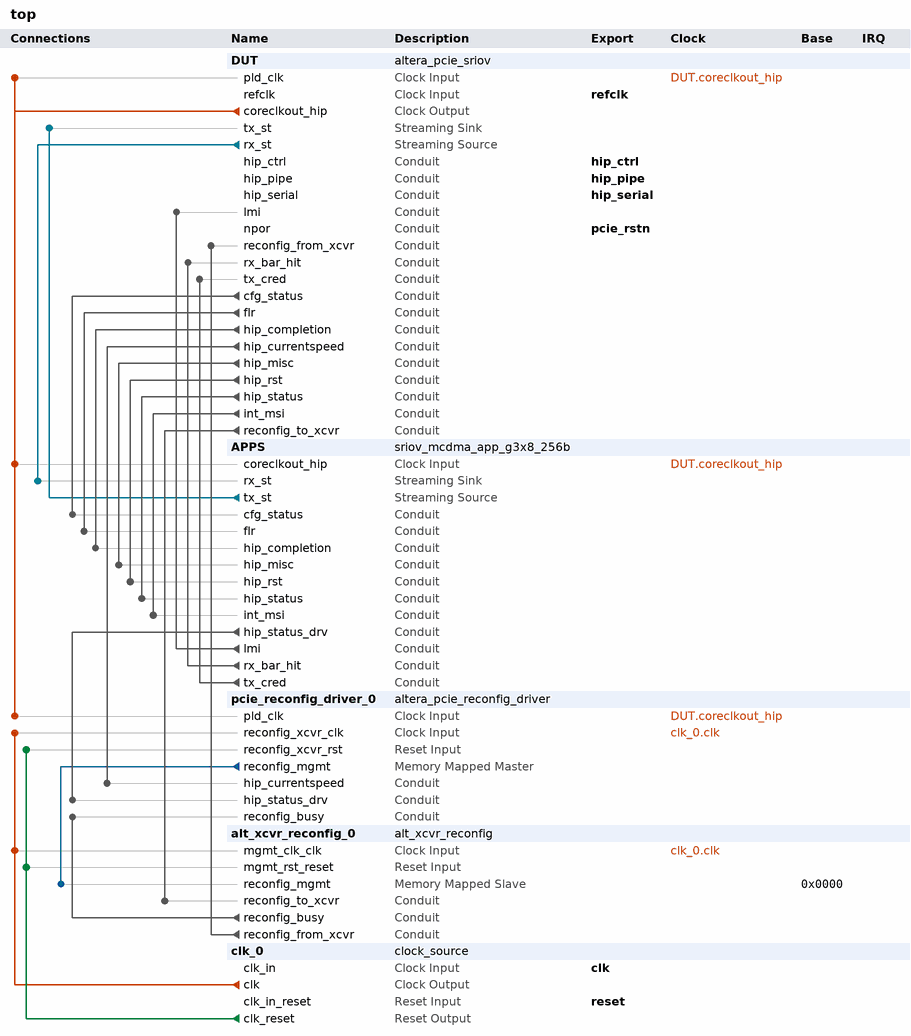
[diagram p0: system contents]
# Platform Designer (Qsys) system top, Stratix V Unknown
# Parameters at their usual value, and those the tool derives, are not listed.
package require -exact qsys 14.1
create_system top
set_project_property DEVICE_FAMILY {Stratix V}
set_project_property DEVICE Unknown

add_instance DUT altera_pcie_sriov 14.1
set_instance_parameter_value DUT ACDS_VERSION_HWTCL 14.0
set_instance_parameter_value DUT ARI_SUPPORT 1
set_instance_parameter_value DUT DROP_POISONED_COMPL 0
set_instance_parameter_value DUT DROP_POISONED_REQ 0
set_instance_parameter_value DUT LOG_VF_ERRORS_IN_PF 0
set_instance_parameter_value DUT PF0_BAR0_PREFETCHABLE 1
set_instance_parameter_value DUT PF0_BAR0_PRESENT 1
set_instance_parameter_value DUT PF0_BAR0_SIZE 17
set_instance_parameter_value DUT PF0_BAR0_TYPE 1
set_instance_parameter_value DUT PF0_BAR1_PREFETCHABLE 1
set_instance_parameter_value DUT PF0_BAR1_PRESENT 0
set_instance_parameter_value DUT PF0_BAR1_SIZE 12
set_instance_parameter_value DUT PF0_BAR2_PREFETCHABLE 1
set_instance_parameter_value DUT PF0_BAR2_PRESENT 0
set_instance_parameter_value DUT PF0_BAR2_SIZE 12
set_instance_parameter_value DUT PF0_BAR2_TYPE 1
set_instance_parameter_value DUT PF0_BAR3_PREFETCHABLE 1
set_instance_parameter_value DUT PF0_BAR3_PRESENT 0
set_instance_parameter_value DUT PF0_BAR3_SIZE 12
set_instance_parameter_value DUT PF0_BAR4_PREFETCHABLE 1
set_instance_parameter_value DUT PF0_BAR4_PRESENT 0
set_instance_parameter_value DUT PF0_BAR4_SIZE 12
set_instance_parameter_value DUT PF0_BAR4_TYPE 1
set_instance_parameter_value DUT PF0_BAR5_PREFETCHABLE 1
set_instance_parameter_value DUT PF0_BAR5_PRESENT 0
set_instance_parameter_value DUT PF0_BAR5_SIZE 12
set_instance_parameter_value DUT PF0_INTR_LINE 0
set_instance_parameter_value DUT PF0_PCI_PROG_INTFC_BYTE 0
set_instance_parameter_value DUT PF0_SUBCLASS_CODE 0
set_instance_parameter_value DUT PF0_VF_BAR0_PREFETCHABLE 1
set_instance_parameter_value DUT PF0_VF_BAR0_PRESENT 1
set_instance_parameter_value DUT PF0_VF_BAR0_SIZE 16
set_instance_parameter_value DUT PF0_VF_BAR0_TYPE 1
set_instance_parameter_value DUT PF0_VF_BAR1_PREFETCHABLE 1
set_instance_parameter_value DUT PF0_VF_BAR1_PRESENT 0
set_instance_parameter_value DUT PF0_VF_BAR1_SIZE 12
set_instance_parameter_value DUT PF0_VF_BAR2_PREFETCHABLE 1
set_instance_parameter_value DUT PF0_VF_BAR2_PRESENT 0
set_instance_parameter_value DUT PF0_VF_BAR2_SIZE 12
set_instance_parameter_value DUT PF0_VF_BAR2_TYPE 1
set_instance_parameter_value DUT PF0_VF_BAR3_PREFETCHABLE 1
set_instance_parameter_value DUT PF0_VF_BAR3_PRESENT 0
set_instance_parameter_value DUT PF0_VF_BAR3_SIZE 12
set_instance_parameter_value DUT PF0_VF_BAR4_PREFETCHABLE 1
set_instance_parameter_value DUT PF0_VF_BAR4_PRESENT 0
set_instance_parameter_value DUT PF0_VF_BAR4_SIZE 12
set_instance_parameter_value DUT PF0_VF_BAR4_TYPE 1
set_instance_parameter_value DUT PF0_VF_BAR5_PREFETCHABLE 1
set_instance_parameter_value DUT PF0_VF_BAR5_PRESENT 0
set_instance_parameter_value DUT PF0_VF_BAR5_SIZE 12
set_instance_parameter_value DUT PF0_VF_COUNT_USER 4
set_instance_parameter_value DUT PF0_VF_DEVICE_ID 51966
set_instance_parameter_value DUT PF0_VF_MSIX_PBA_BIR 0
set_instance_parameter_value DUT PF0_VF_MSIX_PBA_OFFSET 8192
set_instance_parameter_value DUT PF0_VF_MSIX_TBL_BIR 0
set_instance_parameter_value DUT PF0_VF_MSIX_TBL_OFFSET 4096
set_instance_parameter_value DUT PF0_VF_MSIX_TBL_SIZE 128
set_instance_parameter_value DUT PF1_BAR0_PREFETCHABLE 1
set_instance_parameter_value DUT PF1_BAR0_PRESENT 0
set_instance_parameter_value DUT PF1_BAR0_SIZE 12
set_instance_parameter_value DUT PF1_BAR0_TYPE 1
set_instance_parameter_value DUT PF1_BAR1_PREFETCHABLE 1
set_instance_parameter_value DUT PF1_BAR1_PRESENT 0
set_instance_parameter_value DUT PF1_BAR1_SIZE 12
set_instance_parameter_value DUT PF1_BAR2_PREFETCHABLE 1
set_instance_parameter_value DUT PF1_BAR2_PRESENT 0
set_instance_parameter_value DUT PF1_BAR2_SIZE 12
set_instance_parameter_value DUT PF1_BAR2_TYPE 1
set_instance_parameter_value DUT PF1_BAR3_PREFETCHABLE 1
set_instance_parameter_value DUT PF1_BAR3_PRESENT 0
set_instance_parameter_value DUT PF1_BAR3_SIZE 12
set_instance_parameter_value DUT PF1_BAR4_PREFETCHABLE 1
set_instance_parameter_value DUT PF1_BAR4_PRESENT 0
set_instance_parameter_value DUT PF1_BAR4_SIZE 12
set_instance_parameter_value DUT PF1_BAR4_TYPE 1
set_instance_parameter_value DUT PF1_BAR5_PREFETCHABLE 1
set_instance_parameter_value DUT PF1_BAR5_PRESENT 0
set_instance_parameter_value DUT PF1_BAR5_SIZE 12
set_instance_parameter_value DUT PF1_INTR_LINE 0
set_instance_parameter_value DUT PF1_PCI_PROG_INTFC_BYTE 0
set_instance_parameter_value DUT PF1_SUBCLASS_CODE 0
set_instance_parameter_value DUT PF1_VF_BAR0_PREFETCHABLE 1
set_instance_parameter_value DUT PF1_VF_BAR0_PRESENT 0
set_instance_parameter_value DUT PF1_VF_BAR0_SIZE 12
set_instance_parameter_value DUT PF1_VF_BAR0_TYPE 1
set_instance_parameter_value DUT PF1_VF_BAR1_PREFETCHABLE 1
set_instance_parameter_value DUT PF1_VF_BAR1_PRESENT 0
set_instance_parameter_value DUT PF1_VF_BAR1_SIZE 12
set_instance_parameter_value DUT PF1_VF_BAR2_PREFETCHABLE 1
set_instance_parameter_value DUT PF1_VF_BAR2_PRESENT 0
set_instance_parameter_value DUT PF1_VF_BAR2_SIZE 12
set_instance_parameter_value DUT PF1_VF_BAR2_TYPE 1
set_instance_parameter_value DUT PF1_VF_BAR3_PREFETCHABLE 1
set_instance_parameter_value DUT PF1_VF_BAR3_PRESENT 0
set_instance_parameter_value DUT PF1_VF_BAR3_SIZE 12
set_instance_parameter_value DUT PF1_VF_BAR4_PREFETCHABLE 1
set_instance_parameter_value DUT PF1_VF_BAR4_PRESENT 0
set_instance_parameter_value DUT PF1_VF_BAR4_SIZE 12
set_instance_parameter_value DUT PF1_VF_BAR4_TYPE 1
set_instance_parameter_value DUT PF1_VF_BAR5_PREFETCHABLE 1
set_instance_parameter_value DUT PF1_VF_BAR5_PRESENT 0
set_instance_parameter_value DUT PF1_VF_BAR5_SIZE 12
set_instance_parameter_value DUT PF1_VF_COUNT_USER 0
set_instance_parameter_value DUT PF1_VF_DEVICE_ID 0
set_instance_parameter_value DUT PF1_VF_MSIX_PBA_BIR 0
set_instance_parameter_value DUT PF1_VF_MSIX_PBA_OFFSET 0
set_instance_parameter_value DUT PF1_VF_MSIX_TBL_BIR 0
set_instance_parameter_value DUT PF1_VF_MSIX_TBL_OFFSET 0
set_instance_parameter_value DUT PF1_VF_MSIX_TBL_SIZE 0
set_instance_parameter_value DUT RELAXED_ORDER_SUPPORT 1
set_instance_parameter_value DUT SIG_TEST_EN 0
set_instance_parameter_value DUT SIM_SRIOV_DMA 1
set_instance_parameter_value DUT SR_IOV_SUPPORT 1
set_instance_parameter_value DUT SYSTEM_PAGE_SIZES_SUPPORTED 1363
set_instance_parameter_value DUT TOTAL_PF_COUNT 1
set_instance_parameter_value DUT VF_MSIX_CAP_PRESENT 1
set_instance_parameter_value DUT advanced_default_hwtcl_atomic_malformed true
set_instance_parameter_value DUT advanced_default_hwtcl_atomic_op_completer_32bit false
set_instance_parameter_value DUT advanced_default_hwtcl_atomic_op_completer_64bit false
set_instance_parameter_value DUT advanced_default_hwtcl_atomic_op_routing false
set_instance_parameter_value DUT advanced_default_hwtcl_bridge_port_ssid_support false
set_instance_parameter_value DUT advanced_default_hwtcl_bridge_port_vga_enable false
set_instance_parameter_value DUT advanced_default_hwtcl_bypass_cdc false
set_instance_parameter_value DUT advanced_default_hwtcl_cas_completer_128bit false
set_instance_parameter_value DUT advanced_default_hwtcl_cdc_dummy_insert_limit 11
set_instance_parameter_value DUT advanced_default_hwtcl_d0_pme false
set_instance_parameter_value DUT advanced_default_hwtcl_d1_pme false
set_instance_parameter_value DUT advanced_default_hwtcl_d1_support false
set_instance_parameter_value DUT advanced_default_hwtcl_d2_pme false
set_instance_parameter_value DUT advanced_default_hwtcl_d2_support false
set_instance_parameter_value DUT advanced_default_hwtcl_d3_cold_pme false
set_instance_parameter_value DUT advanced_default_hwtcl_d3_hot_pme false
set_instance_parameter_value DUT advanced_default_hwtcl_data_pack_rx disable
set_instance_parameter_value DUT advanced_default_hwtcl_deskew_comma com_deskw
set_instance_parameter_value DUT advanced_default_hwtcl_device_number 0
set_instance_parameter_value DUT advanced_default_hwtcl_disable_link_x2_support false
set_instance_parameter_value DUT advanced_default_hwtcl_disable_snoop_packet false
set_instance_parameter_value DUT advanced_default_hwtcl_ei_delay_powerdown_count 10
set_instance_parameter_value DUT advanced_default_hwtcl_eie_before_nfts_count 4
set_instance_parameter_value DUT advanced_default_hwtcl_enable_adapter_half_rate_mode false
set_instance_parameter_value DUT advanced_default_hwtcl_enable_l1_aspm false
set_instance_parameter_value DUT advanced_default_hwtcl_enable_rx_buffer_checking false
set_instance_parameter_value DUT advanced_default_hwtcl_extended_format_field false
set_instance_parameter_value DUT advanced_default_hwtcl_extended_tag_reset false
set_instance_parameter_value DUT advanced_default_hwtcl_fc_init_timer 1024
set_instance_parameter_value DUT advanced_default_hwtcl_flow_control_timeout_count 200
set_instance_parameter_value DUT advanced_default_hwtcl_flow_control_update_count 30
set_instance_parameter_value DUT advanced_default_hwtcl_flr_capability false
set_instance_parameter_value DUT advanced_default_hwtcl_gen2_diffclock_nfts_count 255
set_instance_parameter_value DUT advanced_default_hwtcl_gen2_sameclock_nfts_count 255
set_instance_parameter_value DUT advanced_default_hwtcl_hot_plug_support 0
set_instance_parameter_value DUT advanced_default_hwtcl_interrupt_pin inta
set_instance_parameter_value DUT advanced_default_hwtcl_l01_entry_latency 31
set_instance_parameter_value DUT advanced_default_hwtcl_l0_exit_latency_diffclock 6
set_instance_parameter_value DUT advanced_default_hwtcl_l0_exit_latency_sameclock 6
set_instance_parameter_value DUT advanced_default_hwtcl_l1_exit_latency_diffclock 0
set_instance_parameter_value DUT advanced_default_hwtcl_l1_exit_latency_sameclock 0
set_instance_parameter_value DUT advanced_default_hwtcl_low_priority_vc single_vc
set_instance_parameter_value DUT advanced_default_hwtcl_ltr_mechanism false
set_instance_parameter_value DUT advanced_default_hwtcl_ltssm_1ms_timeout disable
set_instance_parameter_value DUT advanced_default_hwtcl_ltssm_freqlocked_check disable
set_instance_parameter_value DUT advanced_default_hwtcl_maximum_current 0
set_instance_parameter_value DUT advanced_default_hwtcl_no_command_completed true
set_instance_parameter_value DUT advanced_default_hwtcl_no_soft_reset false
set_instance_parameter_value DUT advanced_default_hwtcl_pclk_out_sel pclk
set_instance_parameter_value DUT advanced_default_hwtcl_pipex1_debug_sel disable
set_instance_parameter_value DUT advanced_default_hwtcl_register_pipe_signals false
set_instance_parameter_value DUT advanced_default_hwtcl_reserved_debug 0
set_instance_parameter_value DUT advanced_default_hwtcl_retry_buffer_last_active_address 2047
set_instance_parameter_value DUT advanced_default_hwtcl_rx_l0s_count_idl 0
set_instance_parameter_value DUT advanced_default_hwtcl_set_l0s 0
set_instance_parameter_value DUT advanced_default_hwtcl_skp_os_gen3_count 0
set_instance_parameter_value DUT advanced_default_hwtcl_skp_os_schedule_count 0
set_instance_parameter_value DUT advanced_default_hwtcl_ssid 0
set_instance_parameter_value DUT advanced_default_hwtcl_ssvid 0
set_instance_parameter_value DUT advanced_default_hwtcl_tph_completer false
set_instance_parameter_value DUT advanced_default_hwtcl_tx_cdc_almost_empty 5
set_instance_parameter_value DUT advanced_default_hwtcl_vc0_clk_enable true
set_instance_parameter_value DUT advanced_default_hwtcl_wrong_device_id disable
set_instance_parameter_value DUT advanced_default_parameter_override 0
set_instance_parameter_value DUT ast_width_hwtcl {Avalon-ST 256-bit}
set_instance_parameter_value DUT change_deemphasis_hwtcl 0
set_instance_parameter_value DUT class_code_hwtcl 2
set_instance_parameter_value DUT completion_timeout_hwtcl ABCD
set_instance_parameter_value DUT device_id_hwtcl 57345
set_instance_parameter_value DUT dll_active_report_support_hwtcl 0
set_instance_parameter_value DUT ecrc_check_capable_hwtcl 0
set_instance_parameter_value DUT ecrc_gen_capable_hwtcl 0
set_instance_parameter_value DUT enable_completion_timeout_disable_hwtcl 1
set_instance_parameter_value DUT enable_function_msix_support_hwtcl 1
set_instance_parameter_value DUT enable_pcisigtest_hwtcl 0
set_instance_parameter_value DUT enable_pipe32_phyip_ser_driver_hwtcl 0
set_instance_parameter_value DUT enable_pipe32_sim_hwtcl 0
set_instance_parameter_value DUT enable_power_on_rst_pulse_hwtcl 0
set_instance_parameter_value DUT enable_slot_register_hwtcl 0
set_instance_parameter_value DUT enable_tl_only_sim_hwtcl 0
set_instance_parameter_value DUT endpoint_l0_latency_hwtcl 0
set_instance_parameter_value DUT endpoint_l1_latency_hwtcl 0
set_instance_parameter_value DUT extend_tag_field_hwtcl 32
set_instance_parameter_value DUT fixed_preset_on 0
set_instance_parameter_value DUT force_hrc 0
set_instance_parameter_value DUT force_src 0
set_instance_parameter_value DUT full_swing_hwtcl 35
set_instance_parameter_value DUT gen123_lane_rate_mode_hwtcl {Gen3 (8.0 Gbps)}
set_instance_parameter_value DUT gen3_coeff_10_ber_meas_hwtcl 0
set_instance_parameter_value DUT gen3_coeff_10_hwtcl 0
set_instance_parameter_value DUT gen3_coeff_10_nxtber_less_hwtcl g3_coeff_10_nxtber_less
set_instance_parameter_value DUT gen3_coeff_10_nxtber_less_ptr_hwtcl 0
set_instance_parameter_value DUT gen3_coeff_10_nxtber_more_hwtcl g3_coeff_10_nxtber_more
set_instance_parameter_value DUT gen3_coeff_10_nxtber_more_ptr_hwtcl 0
set_instance_parameter_value DUT gen3_coeff_10_preset_hint_hwtcl 0
set_instance_parameter_value DUT gen3_coeff_10_reqber_hwtcl 0
set_instance_parameter_value DUT gen3_coeff_10_sel_hwtcl preset_10
set_instance_parameter_value DUT gen3_coeff_11_ber_meas_hwtcl 0
set_instance_parameter_value DUT gen3_coeff_11_hwtcl 0
set_instance_parameter_value DUT gen3_coeff_11_nxtber_less_hwtcl g3_coeff_11_nxtber_less
set_instance_parameter_value DUT gen3_coeff_11_nxtber_less_ptr_hwtcl 0
set_instance_parameter_value DUT gen3_coeff_11_nxtber_more_hwtcl g3_coeff_11_nxtber_more
set_instance_parameter_value DUT gen3_coeff_11_nxtber_more_ptr_hwtcl 0
set_instance_parameter_value DUT gen3_coeff_11_preset_hint_hwtcl 0
set_instance_parameter_value DUT gen3_coeff_11_reqber_hwtcl 0
set_instance_parameter_value DUT gen3_coeff_11_sel_hwtcl preset_11
set_instance_parameter_value DUT gen3_coeff_12_ber_meas_hwtcl 0
set_instance_parameter_value DUT gen3_coeff_12_hwtcl 0
set_instance_parameter_value DUT gen3_coeff_12_nxtber_less_hwtcl g3_coeff_12_nxtber_less
set_instance_parameter_value DUT gen3_coeff_12_nxtber_less_ptr_hwtcl 0
set_instance_parameter_value DUT gen3_coeff_12_nxtber_more_hwtcl g3_coeff_12_nxtber_more
set_instance_parameter_value DUT gen3_coeff_12_nxtber_more_ptr_hwtcl 0
set_instance_parameter_value DUT gen3_coeff_12_preset_hint_hwtcl 0
set_instance_parameter_value DUT gen3_coeff_12_reqber_hwtcl 0
set_instance_parameter_value DUT gen3_coeff_12_sel_hwtcl preset_12
set_instance_parameter_value DUT gen3_coeff_13_ber_meas_hwtcl 0
set_instance_parameter_value DUT gen3_coeff_13_hwtcl 0
set_instance_parameter_value DUT gen3_coeff_13_nxtber_less_hwtcl g3_coeff_13_nxtber_less
set_instance_parameter_value DUT gen3_coeff_13_nxtber_less_ptr_hwtcl 0
set_instance_parameter_value DUT gen3_coeff_13_nxtber_more_hwtcl g3_coeff_13_nxtber_more
set_instance_parameter_value DUT gen3_coeff_13_nxtber_more_ptr_hwtcl 0
set_instance_parameter_value DUT gen3_coeff_13_preset_hint_hwtcl 0
set_instance_parameter_value DUT gen3_coeff_13_reqber_hwtcl 0
set_instance_parameter_value DUT gen3_coeff_13_sel_hwtcl preset_13
set_instance_parameter_value DUT gen3_coeff_14_ber_meas_hwtcl 0
set_instance_parameter_value DUT gen3_coeff_14_hwtcl 0
set_instance_parameter_value DUT gen3_coeff_14_nxtber_less_hwtcl g3_coeff_14_nxtber_less
set_instance_parameter_value DUT gen3_coeff_14_nxtber_less_ptr_hwtcl 0
set_instance_parameter_value DUT gen3_coeff_14_nxtber_more_hwtcl g3_coeff_14_nxtber_more
set_instance_parameter_value DUT gen3_coeff_14_nxtber_more_ptr_hwtcl 0
set_instance_parameter_value DUT gen3_coeff_14_preset_hint_hwtcl 0
set_instance_parameter_value DUT gen3_coeff_14_reqber_hwtcl 0
set_instance_parameter_value DUT gen3_coeff_14_sel_hwtcl preset_14
set_instance_parameter_value DUT gen3_coeff_15_ber_meas_hwtcl 0
set_instance_parameter_value DUT gen3_coeff_15_hwtcl 0
set_instance_parameter_value DUT gen3_coeff_15_nxtber_less_hwtcl g3_coeff_15_nxtber_less
set_instance_parameter_value DUT gen3_coeff_15_nxtber_less_ptr_hwtcl 0
set_instance_parameter_value DUT gen3_coeff_15_nxtber_more_hwtcl g3_coeff_15_nxtber_more
set_instance_parameter_value DUT gen3_coeff_15_nxtber_more_ptr_hwtcl 0
set_instance_parameter_value DUT gen3_coeff_15_preset_hint_hwtcl 0
set_instance_parameter_value DUT gen3_coeff_15_reqber_hwtcl 0
set_instance_parameter_value DUT gen3_coeff_15_sel_hwtcl preset_15
set_instance_parameter_value DUT gen3_coeff_16_ber_meas_hwtcl 0
set_instance_parameter_value DUT gen3_coeff_16_hwtcl 0
set_instance_parameter_value DUT gen3_coeff_16_nxtber_less_hwtcl g3_coeff_16_nxtber_less
set_instance_parameter_value DUT gen3_coeff_16_nxtber_less_ptr_hwtcl 0
set_instance_parameter_value DUT gen3_coeff_16_nxtber_more_hwtcl g3_coeff_16_nxtber_more
set_instance_parameter_value DUT gen3_coeff_16_nxtber_more_ptr_hwtcl 0
set_instance_parameter_value DUT gen3_coeff_16_preset_hint_hwtcl 0
set_instance_parameter_value DUT gen3_coeff_16_reqber_hwtcl 0
set_instance_parameter_value DUT gen3_coeff_16_sel_hwtcl preset_16
set_instance_parameter_value DUT gen3_coeff_17_ber_meas_hwtcl 0
set_instance_parameter_value DUT gen3_coeff_17_hwtcl 0
set_instance_parameter_value DUT gen3_coeff_17_nxtber_less_hwtcl g3_coeff_17_nxtber_less
set_instance_parameter_value DUT gen3_coeff_17_nxtber_less_ptr_hwtcl 0
set_instance_parameter_value DUT gen3_coeff_17_nxtber_more_hwtcl g3_coeff_17_nxtber_more
set_instance_parameter_value DUT gen3_coeff_17_nxtber_more_ptr_hwtcl 0
set_instance_parameter_value DUT gen3_coeff_17_preset_hint_hwtcl 0
set_instance_parameter_value DUT gen3_coeff_17_reqber_hwtcl 0
set_instance_parameter_value DUT gen3_coeff_17_sel_hwtcl preset_17
set_instance_parameter_value DUT gen3_coeff_18_ber_meas_hwtcl 0
set_instance_parameter_value DUT gen3_coeff_18_hwtcl 0
set_instance_parameter_value DUT gen3_coeff_18_nxtber_less_hwtcl g3_coeff_18_nxtber_less
set_instance_parameter_value DUT gen3_coeff_18_nxtber_less_ptr_hwtcl 0
set_instance_parameter_value DUT gen3_coeff_18_nxtber_more_hwtcl g3_coeff_18_nxtber_more
set_instance_parameter_value DUT gen3_coeff_18_nxtber_more_ptr_hwtcl 0
set_instance_parameter_value DUT gen3_coeff_18_preset_hint_hwtcl 0
set_instance_parameter_value DUT gen3_coeff_18_reqber_hwtcl 0
set_instance_parameter_value DUT gen3_coeff_18_sel_hwtcl preset_18
set_instance_parameter_value DUT gen3_coeff_19_ber_meas_hwtcl 0
set_instance_parameter_value DUT gen3_coeff_19_hwtcl 0
set_instance_parameter_value DUT gen3_coeff_19_nxtber_less_hwtcl g3_coeff_19_nxtber_less
set_instance_parameter_value DUT gen3_coeff_19_nxtber_less_ptr_hwtcl 0
set_instance_parameter_value DUT gen3_coeff_19_nxtber_more_hwtcl g3_coeff_19_nxtber_more
set_instance_parameter_value DUT gen3_coeff_19_nxtber_more_ptr_hwtcl 0
set_instance_parameter_value DUT gen3_coeff_19_preset_hint_hwtcl 0
set_instance_parameter_value DUT gen3_coeff_19_reqber_hwtcl 0
set_instance_parameter_value DUT gen3_coeff_19_sel_hwtcl preset_19
set_instance_parameter_value DUT gen3_coeff_1_ber_meas_hwtcl 2
set_instance_parameter_value DUT gen3_coeff_1_hwtcl 7
set_instance_parameter_value DUT gen3_coeff_1_nxtber_less_hwtcl g3_coeff_1_nxtber_less
set_instance_parameter_value DUT gen3_coeff_1_nxtber_less_ptr_hwtcl 1
set_instance_parameter_value DUT gen3_coeff_1_nxtber_more_hwtcl g3_coeff_1_nxtber_more
set_instance_parameter_value DUT gen3_coeff_1_nxtber_more_ptr_hwtcl 1
set_instance_parameter_value DUT gen3_coeff_1_preset_hint_hwtcl 0
set_instance_parameter_value DUT gen3_coeff_1_reqber_hwtcl 0
set_instance_parameter_value DUT gen3_coeff_1_sel_hwtcl preset_1
set_instance_parameter_value DUT gen3_coeff_20_ber_meas_hwtcl 0
set_instance_parameter_value DUT gen3_coeff_20_hwtcl 0
set_instance_parameter_value DUT gen3_coeff_20_nxtber_less_hwtcl g3_coeff_20_nxtber_less
set_instance_parameter_value DUT gen3_coeff_20_nxtber_less_ptr_hwtcl 0
set_instance_parameter_value DUT gen3_coeff_20_nxtber_more_hwtcl g3_coeff_20_nxtber_more
set_instance_parameter_value DUT gen3_coeff_20_nxtber_more_ptr_hwtcl 0
set_instance_parameter_value DUT gen3_coeff_20_preset_hint_hwtcl 0
set_instance_parameter_value DUT gen3_coeff_20_reqber_hwtcl 0
set_instance_parameter_value DUT gen3_coeff_20_sel_hwtcl preset_20
set_instance_parameter_value DUT gen3_coeff_21_ber_meas_hwtcl 0
set_instance_parameter_value DUT gen3_coeff_21_hwtcl 0
set_instance_parameter_value DUT gen3_coeff_21_nxtber_less_hwtcl g3_coeff_21_nxtber_less
set_instance_parameter_value DUT gen3_coeff_21_nxtber_less_ptr_hwtcl 0
set_instance_parameter_value DUT gen3_coeff_21_nxtber_more_hwtcl g3_coeff_21_nxtber_more
set_instance_parameter_value DUT gen3_coeff_21_nxtber_more_ptr_hwtcl 0
set_instance_parameter_value DUT gen3_coeff_21_preset_hint_hwtcl 0
set_instance_parameter_value DUT gen3_coeff_21_reqber_hwtcl 0
set_instance_parameter_value DUT gen3_coeff_21_sel_hwtcl preset_21
set_instance_parameter_value DUT gen3_coeff_22_ber_meas_hwtcl 0
set_instance_parameter_value DUT gen3_coeff_22_hwtcl 0
set_instance_parameter_value DUT gen3_coeff_22_nxtber_less_hwtcl g3_coeff_22_nxtber_less
set_instance_parameter_value DUT gen3_coeff_22_nxtber_less_ptr_hwtcl 0
set_instance_parameter_value DUT gen3_coeff_22_nxtber_more_hwtcl g3_coeff_22_nxtber_more
set_instance_parameter_value DUT gen3_coeff_22_nxtber_more_ptr_hwtcl 0
set_instance_parameter_value DUT gen3_coeff_22_preset_hint_hwtcl 0
set_instance_parameter_value DUT gen3_coeff_22_reqber_hwtcl 0
set_instance_parameter_value DUT gen3_coeff_22_sel_hwtcl preset_22
set_instance_parameter_value DUT gen3_coeff_23_ber_meas_hwtcl 0
set_instance_parameter_value DUT gen3_coeff_23_hwtcl 0
set_instance_parameter_value DUT gen3_coeff_23_nxtber_less_hwtcl g3_coeff_23_nxtber_less
set_instance_parameter_value DUT gen3_coeff_23_nxtber_less_ptr_hwtcl 0
set_instance_parameter_value DUT gen3_coeff_23_nxtber_more_hwtcl g3_coeff_23_nxtber_more
set_instance_parameter_value DUT gen3_coeff_23_nxtber_more_ptr_hwtcl 0
set_instance_parameter_value DUT gen3_coeff_23_preset_hint_hwtcl 0
set_instance_parameter_value DUT gen3_coeff_23_reqber_hwtcl 0
set_instance_parameter_value DUT gen3_coeff_23_sel_hwtcl preset_23
set_instance_parameter_value DUT gen3_coeff_24_ber_meas_hwtcl 0
set_instance_parameter_value DUT gen3_coeff_24_hwtcl 0
set_instance_parameter_value DUT gen3_coeff_24_nxtber_less_hwtcl g3_coeff_24_nxtber_less
set_instance_parameter_value DUT gen3_coeff_24_nxtber_less_ptr_hwtcl 0
set_instance_parameter_value DUT gen3_coeff_24_nxtber_more_hwtcl g3_coeff_24_nxtber_more
set_instance_parameter_value DUT gen3_coeff_24_nxtber_more_ptr_hwtcl 0
set_instance_parameter_value DUT gen3_coeff_24_preset_hint_hwtcl 0
set_instance_parameter_value DUT gen3_coeff_24_reqber_hwtcl 0
set_instance_parameter_value DUT gen3_coeff_24_sel_hwtcl preset_24
set_instance_parameter_value DUT gen3_coeff_2_ber_meas_hwtcl 0
set_instance_parameter_value DUT gen3_coeff_2_hwtcl 0
set_instance_parameter_value DUT gen3_coeff_2_nxtber_less_hwtcl g3_coeff_2_nxtber_less
set_instance_parameter_value DUT gen3_coeff_2_nxtber_less_ptr_hwtcl 0
set_instance_parameter_value DUT gen3_coeff_2_nxtber_more_hwtcl g3_coeff_2_nxtber_more
set_instance_parameter_value DUT gen3_coeff_2_nxtber_more_ptr_hwtcl 0
set_instance_parameter_value DUT gen3_coeff_2_preset_hint_hwtcl 0
set_instance_parameter_value DUT gen3_coeff_2_reqber_hwtcl 0
set_instance_parameter_value DUT gen3_coeff_2_sel_hwtcl preset_2
set_instance_parameter_value DUT gen3_coeff_3_ber_meas_hwtcl 0
set_instance_parameter_value DUT gen3_coeff_3_hwtcl 0
set_instance_parameter_value DUT gen3_coeff_3_nxtber_less_hwtcl g3_coeff_3_nxtber_less
set_instance_parameter_value DUT gen3_coeff_3_nxtber_less_ptr_hwtcl 0
set_instance_parameter_value DUT gen3_coeff_3_nxtber_more_hwtcl g3_coeff_3_nxtber_more
set_instance_parameter_value DUT gen3_coeff_3_nxtber_more_ptr_hwtcl 0
set_instance_parameter_value DUT gen3_coeff_3_preset_hint_hwtcl 0
set_instance_parameter_value DUT gen3_coeff_3_reqber_hwtcl 0
set_instance_parameter_value DUT gen3_coeff_3_sel_hwtcl preset_3
set_instance_parameter_value DUT gen3_coeff_4_ber_meas_hwtcl 0
set_instance_parameter_value DUT gen3_coeff_4_hwtcl 0
set_instance_parameter_value DUT gen3_coeff_4_nxtber_less_hwtcl g3_coeff_4_nxtber_less
set_instance_parameter_value DUT gen3_coeff_4_nxtber_less_ptr_hwtcl 0
set_instance_parameter_value DUT gen3_coeff_4_nxtber_more_hwtcl g3_coeff_4_nxtber_more
set_instance_parameter_value DUT gen3_coeff_4_nxtber_more_ptr_hwtcl 0
set_instance_parameter_value DUT gen3_coeff_4_preset_hint_hwtcl 0
set_instance_parameter_value DUT gen3_coeff_4_reqber_hwtcl 0
set_instance_parameter_value DUT gen3_coeff_4_sel_hwtcl preset_4
set_instance_parameter_value DUT gen3_coeff_5_ber_meas_hwtcl 0
set_instance_parameter_value DUT gen3_coeff_5_hwtcl 0
set_instance_parameter_value DUT gen3_coeff_5_nxtber_less_hwtcl g3_coeff_5_nxtber_less
set_instance_parameter_value DUT gen3_coeff_5_nxtber_less_ptr_hwtcl 0
set_instance_parameter_value DUT gen3_coeff_5_nxtber_more_hwtcl g3_coeff_5_nxtber_more
set_instance_parameter_value DUT gen3_coeff_5_nxtber_more_ptr_hwtcl 0
set_instance_parameter_value DUT gen3_coeff_5_preset_hint_hwtcl 0
set_instance_parameter_value DUT gen3_coeff_5_reqber_hwtcl 0
set_instance_parameter_value DUT gen3_coeff_5_sel_hwtcl preset_5
set_instance_parameter_value DUT gen3_coeff_6_ber_meas_hwtcl 0
set_instance_parameter_value DUT gen3_coeff_6_hwtcl 0
set_instance_parameter_value DUT gen3_coeff_6_nxtber_less_hwtcl g3_coeff_6_nxtber_less
set_instance_parameter_value DUT gen3_coeff_6_nxtber_less_ptr_hwtcl 0
set_instance_parameter_value DUT gen3_coeff_6_nxtber_more_hwtcl g3_coeff_6_nxtber_more
set_instance_parameter_value DUT gen3_coeff_6_nxtber_more_ptr_hwtcl 0
set_instance_parameter_value DUT gen3_coeff_6_preset_hint_hwtcl 0
set_instance_parameter_value DUT gen3_coeff_6_reqber_hwtcl 0
set_instance_parameter_value DUT gen3_coeff_6_sel_hwtcl preset_6
set_instance_parameter_value DUT gen3_coeff_7_ber_meas_hwtcl 0
set_instance_parameter_value DUT gen3_coeff_7_hwtcl 0
set_instance_parameter_value DUT gen3_coeff_7_nxtber_less_hwtcl g3_coeff_7_nxtber_less
set_instance_parameter_value DUT gen3_coeff_7_nxtber_less_ptr_hwtcl 0
set_instance_parameter_value DUT gen3_coeff_7_nxtber_more_hwtcl g3_coeff_7_nxtber_more
set_instance_parameter_value DUT gen3_coeff_7_nxtber_more_ptr_hwtcl 0
set_instance_parameter_value DUT gen3_coeff_7_preset_hint_hwtcl 0
set_instance_parameter_value DUT gen3_coeff_7_reqber_hwtcl 0
set_instance_parameter_value DUT gen3_coeff_7_sel_hwtcl preset_7
set_instance_parameter_value DUT gen3_coeff_8_ber_meas_hwtcl 0
set_instance_parameter_value DUT gen3_coeff_8_hwtcl 0
set_instance_parameter_value DUT gen3_coeff_8_nxtber_less_hwtcl g3_coeff_8_nxtber_less
set_instance_parameter_value DUT gen3_coeff_8_nxtber_less_ptr_hwtcl 0
set_instance_parameter_value DUT gen3_coeff_8_nxtber_more_hwtcl g3_coeff_8_nxtber_more
set_instance_parameter_value DUT gen3_coeff_8_nxtber_more_ptr_hwtcl 0
set_instance_parameter_value DUT gen3_coeff_8_preset_hint_hwtcl 0
set_instance_parameter_value DUT gen3_coeff_8_reqber_hwtcl 0
set_instance_parameter_value DUT gen3_coeff_8_sel_hwtcl preset_8
set_instance_parameter_value DUT gen3_coeff_9_ber_meas_hwtcl 0
set_instance_parameter_value DUT gen3_coeff_9_hwtcl 0
set_instance_parameter_value DUT gen3_coeff_9_nxtber_less_hwtcl g3_coeff_9_nxtber_less
set_instance_parameter_value DUT gen3_coeff_9_nxtber_less_ptr_hwtcl 0
set_instance_parameter_value DUT gen3_coeff_9_nxtber_more_hwtcl g3_coeff_9_nxtber_more
set_instance_parameter_value DUT gen3_coeff_9_nxtber_more_ptr_hwtcl 0
set_instance_parameter_value DUT gen3_coeff_9_preset_hint_hwtcl 0
set_instance_parameter_value DUT gen3_coeff_9_reqber_hwtcl 0
set_instance_parameter_value DUT gen3_coeff_9_sel_hwtcl preset_9
set_instance_parameter_value DUT gen3_full_swing_hwtcl 35
set_instance_parameter_value DUT gen3_low_freq_hwtcl 0
set_instance_parameter_value DUT gen3_preset_coeff_10_hwtcl 0
set_instance_parameter_value DUT gen3_preset_coeff_11_hwtcl 0
set_instance_parameter_value DUT gen3_preset_coeff_1_hwtcl 0
set_instance_parameter_value DUT gen3_preset_coeff_2_hwtcl 0
set_instance_parameter_value DUT gen3_preset_coeff_3_hwtcl 0
set_instance_parameter_value DUT gen3_preset_coeff_4_hwtcl 0
set_instance_parameter_value DUT gen3_preset_coeff_5_hwtcl 0
set_instance_parameter_value DUT gen3_preset_coeff_6_hwtcl 0
set_instance_parameter_value DUT gen3_preset_coeff_7_hwtcl 0
set_instance_parameter_value DUT gen3_preset_coeff_8_hwtcl 0
set_instance_parameter_value DUT gen3_preset_coeff_9_hwtcl 0
set_instance_parameter_value DUT gen3_rxfreqlock_counter_hwtcl 0
set_instance_parameter_value DUT hip_reconfig_hwtcl 0
set_instance_parameter_value DUT hip_tag_checking_hwtcl 0
set_instance_parameter_value DUT hwtcl_override_g2_txvod 1
set_instance_parameter_value DUT hwtcl_override_g3rxcoef 0
set_instance_parameter_value DUT hwtcl_override_g3txcoef 0
set_instance_parameter_value DUT in_cvp_mode_hwtcl 0
set_instance_parameter_value DUT lane_mask_hwtcl x8
set_instance_parameter_value DUT low_latency_mode_hwtcl 0
set_instance_parameter_value DUT max_payload_size_hwtcl 128
set_instance_parameter_value DUT msi_64bit_addressing_capable_hwtcl 1
set_instance_parameter_value DUT msi_masking_capable_hwtcl false
set_instance_parameter_value DUT msi_multi_message_capable_hwtcl 4
set_instance_parameter_value DUT msi_support_hwtcl 0
set_instance_parameter_value DUT msix_pba_bir_hwtcl 0
set_instance_parameter_value DUT msix_pba_offset_hwtcl 0
set_instance_parameter_value DUT msix_table_bir_hwtcl 0
set_instance_parameter_value DUT msix_table_offset_hwtcl 0
set_instance_parameter_value DUT msix_table_size_hwtcl 0
set_instance_parameter_value DUT multiple_packets_per_cycle_hwtcl 0
set_instance_parameter_value DUT override_rxbuffer_cred_preset 0
set_instance_parameter_value DUT override_tbpartner_driver_setting_hwtcl 0
set_instance_parameter_value DUT pcie_inspector_hwtcl 0
set_instance_parameter_value DUT pcie_qsys 1
set_instance_parameter_value DUT pcie_spec_version_hwtcl 3.0
set_instance_parameter_value DUT pf0_interrupt_pin_hwtcl inta
set_instance_parameter_value DUT pf1_class_code_hwtcl 0
set_instance_parameter_value DUT pf1_device_id_hwtcl 0
set_instance_parameter_value DUT pf1_interrupt_pin_hwtcl inta
set_instance_parameter_value DUT pf1_msi_multi_message_capable_hwtcl 4
set_instance_parameter_value DUT pf1_msix_pba_bir_hwtcl 0
set_instance_parameter_value DUT pf1_msix_pba_offset_hwtcl 8192
set_instance_parameter_value DUT pf1_msix_table_bir_hwtcl 0
set_instance_parameter_value DUT pf1_msix_table_offset_hwtcl 4096
set_instance_parameter_value DUT pf1_msix_table_size_hwtcl 128
set_instance_parameter_value DUT pf1_revision_id_hwtcl 0
set_instance_parameter_value DUT pf1_subsystem_device_id_hwtcl 0
set_instance_parameter_value DUT pf1_subsystem_vendor_id_hwtcl 0
set_instance_parameter_value DUT pf1_vendor_id_hwtcl 0
set_instance_parameter_value DUT pll_refclk_freq_hwtcl {100 MHz}
set_instance_parameter_value DUT port_link_number_hwtcl 1
set_instance_parameter_value DUT port_type_hwtcl {Native endpoint}
set_instance_parameter_value DUT revision_id_hwtcl 0
set_instance_parameter_value DUT rpre_emph_a_val_hwtcl 9
set_instance_parameter_value DUT rpre_emph_b_val_hwtcl 0
set_instance_parameter_value DUT rpre_emph_c_val_hwtcl 16
set_instance_parameter_value DUT rpre_emph_d_val_hwtcl 13
set_instance_parameter_value DUT rpre_emph_e_val_hwtcl 5
set_instance_parameter_value DUT rvod_sel_a_val_hwtcl 42
set_instance_parameter_value DUT rvod_sel_b_val_hwtcl 38
set_instance_parameter_value DUT rvod_sel_c_val_hwtcl 38
set_instance_parameter_value DUT rvod_sel_d_val_hwtcl 43
set_instance_parameter_value DUT rvod_sel_e_val_hwtcl 15
set_instance_parameter_value DUT rxbuffer_rxreq_hwtcl Low
set_instance_parameter_value DUT serial_sim_hwtcl 1
set_instance_parameter_value DUT set_pld_clk_x1_625MHz_hwtcl 0
set_instance_parameter_value DUT slot_number_hwtcl 0
set_instance_parameter_value DUT slot_power_limit_hwtcl 0
set_instance_parameter_value DUT slot_power_scale_hwtcl 0
set_instance_parameter_value DUT slotclkcfg_hwtcl 1
set_instance_parameter_value DUT sriov_flr_capability_hwtcl 0
set_instance_parameter_value DUT subsystem_device_id_hwtcl 57345
set_instance_parameter_value DUT subsystem_vendor_id_hwtcl 4466
set_instance_parameter_value DUT surprise_down_error_support_hwtcl 0
set_instance_parameter_value DUT tlp_insp_trg_dw0_hwtcl 2049
set_instance_parameter_value DUT tlp_insp_trg_dw1_hwtcl 0
set_instance_parameter_value DUT tlp_insp_trg_dw2_hwtcl 0
set_instance_parameter_value DUT tlp_insp_trg_dw3_hwtcl 0
set_instance_parameter_value DUT tlp_inspector_hwtcl 0
set_instance_parameter_value DUT tlp_inspector_use_signal_probe_hwtcl 0
set_instance_parameter_value DUT track_rxfc_cplbuf_ovf_hwtcl 0
set_instance_parameter_value DUT use_aer_hwtcl 1
set_instance_parameter_value DUT use_ast_parity 0
set_instance_parameter_value DUT use_atx_pll_hwtcl 0
set_instance_parameter_value DUT use_config_bypass_hwtcl 1
set_instance_parameter_value DUT use_crc_forwarding_hwtcl 0
set_instance_parameter_value DUT use_cvp_update_core_pof_hwtcl 0
set_instance_parameter_value DUT use_pci_ext_hwtcl 0
set_instance_parameter_value DUT use_pcie_ext_hwtcl 0
set_instance_parameter_value DUT use_rx_st_be_hwtcl 0
set_instance_parameter_value DUT use_tx_cons_cred_sel_hwtcl 0
set_instance_parameter_value DUT vendor_id_hwtcl 4466
set_instance_parameter_value DUT vsec_id_hwtcl 40960
set_instance_parameter_value DUT vsec_rev_hwtcl 0

add_instance APPS sriov_mcdma_app_g3x8_256b 1.0

add_instance pcie_reconfig_driver_0 altera_pcie_reconfig_driver 14.1
set_instance_parameter_value pcie_reconfig_driver_0 gen123_lane_rate_mode_hwtcl {Gen3 (8.0 Gbps)}
set_instance_parameter_value pcie_reconfig_driver_0 number_of_reconfig_interfaces 11

add_instance alt_xcvr_reconfig_0 alt_xcvr_reconfig 14.1
set_instance_parameter_value alt_xcvr_reconfig_0 device_family {Stratix V}
set_instance_parameter_value alt_xcvr_reconfig_0 enable_adce 0
set_instance_parameter_value alt_xcvr_reconfig_0 enable_analog 1
set_instance_parameter_value alt_xcvr_reconfig_0 number_of_reconfig_interfaces 11

add_instance clk_0 clock_source 14.1
set_instance_parameter_value clk_0 clockFrequency 50000000

# connections
add_connection clk_0.clk alt_xcvr_reconfig_0.mgmt_clk_clk clock
add_connection clk_0.clk pcie_reconfig_driver_0.reconfig_xcvr_clk clock
add_connection DUT.coreclkout_hip APPS.coreclkout_hip clock
add_connection DUT.coreclkout_hip DUT.pld_clk clock
add_connection DUT.coreclkout_hip pcie_reconfig_driver_0.pld_clk clock
add_connection clk_0.clk_reset alt_xcvr_reconfig_0.mgmt_rst_reset reset
add_connection clk_0.clk_reset pcie_reconfig_driver_0.reconfig_xcvr_rst reset
add_connection pcie_reconfig_driver_0.reconfig_mgmt alt_xcvr_reconfig_0.reconfig_mgmt avalon
set_connection_parameter_value pcie_reconfig_driver_0.reconfig_mgmt/alt_xcvr_reconfig_0.reconfig_mgmt baseAddress 0x0000
add_connection APPS.tx_st DUT.tx_st avalon_streaming
add_connection DUT.rx_st APPS.rx_st avalon_streaming
add_connection alt_xcvr_reconfig_0.reconfig_busy pcie_reconfig_driver_0.reconfig_busy conduit
add_connection alt_xcvr_reconfig_0.reconfig_from_xcvr DUT.reconfig_from_xcvr conduit
add_connection APPS.hip_status_drv pcie_reconfig_driver_0.hip_status_drv conduit
add_connection APPS.lmi DUT.lmi conduit
add_connection APPS.rx_bar_hit DUT.rx_bar_hit conduit
add_connection APPS.tx_cred DUT.tx_cred conduit
add_connection DUT.cfg_status APPS.cfg_status conduit
add_connection DUT.flr APPS.flr conduit
add_connection DUT.hip_completion APPS.hip_completion conduit
add_connection DUT.hip_currentspeed pcie_reconfig_driver_0.hip_currentspeed conduit
add_connection DUT.hip_misc APPS.hip_misc conduit
add_connection DUT.hip_rst APPS.hip_rst conduit
add_connection DUT.hip_status APPS.hip_status conduit
add_connection DUT.int_msi APPS.int_msi conduit
add_connection DUT.reconfig_to_xcvr alt_xcvr_reconfig_0.reconfig_to_xcvr conduit

# exported interfaces
add_interface clk clock sink
set_interface_property clk EXPORT_OF clk_0.clk_in
add_interface hip_ctrl conduit end
set_interface_property hip_ctrl EXPORT_OF DUT.hip_ctrl
add_interface hip_pipe conduit end
set_interface_property hip_pipe EXPORT_OF DUT.hip_pipe
add_interface hip_serial conduit end
set_interface_property hip_serial EXPORT_OF DUT.hip_serial
add_interface pcie_rstn conduit end
set_interface_property pcie_rstn EXPORT_OF DUT.npor
add_interface refclk clock sink
set_interface_property refclk EXPORT_OF DUT.refclk
add_interface reset reset sink
set_interface_property reset EXPORT_OF clk_0.clk_in_reset

set_interconnect_requirement {$system} qsys_mm.clockCrossingAdapter HANDSHAKE
set_interconnect_requirement {$system} qsys_mm.insertDefaultSlave false
set_interconnect_requirement {$system} qsys_mm.maxAdditionalLatency 1

save_system top.qsys
